# EAGLE schematic K9HZ_100W_Antenna_Tuner_Schematic_V1.10 (EAGLE 7.5.0)
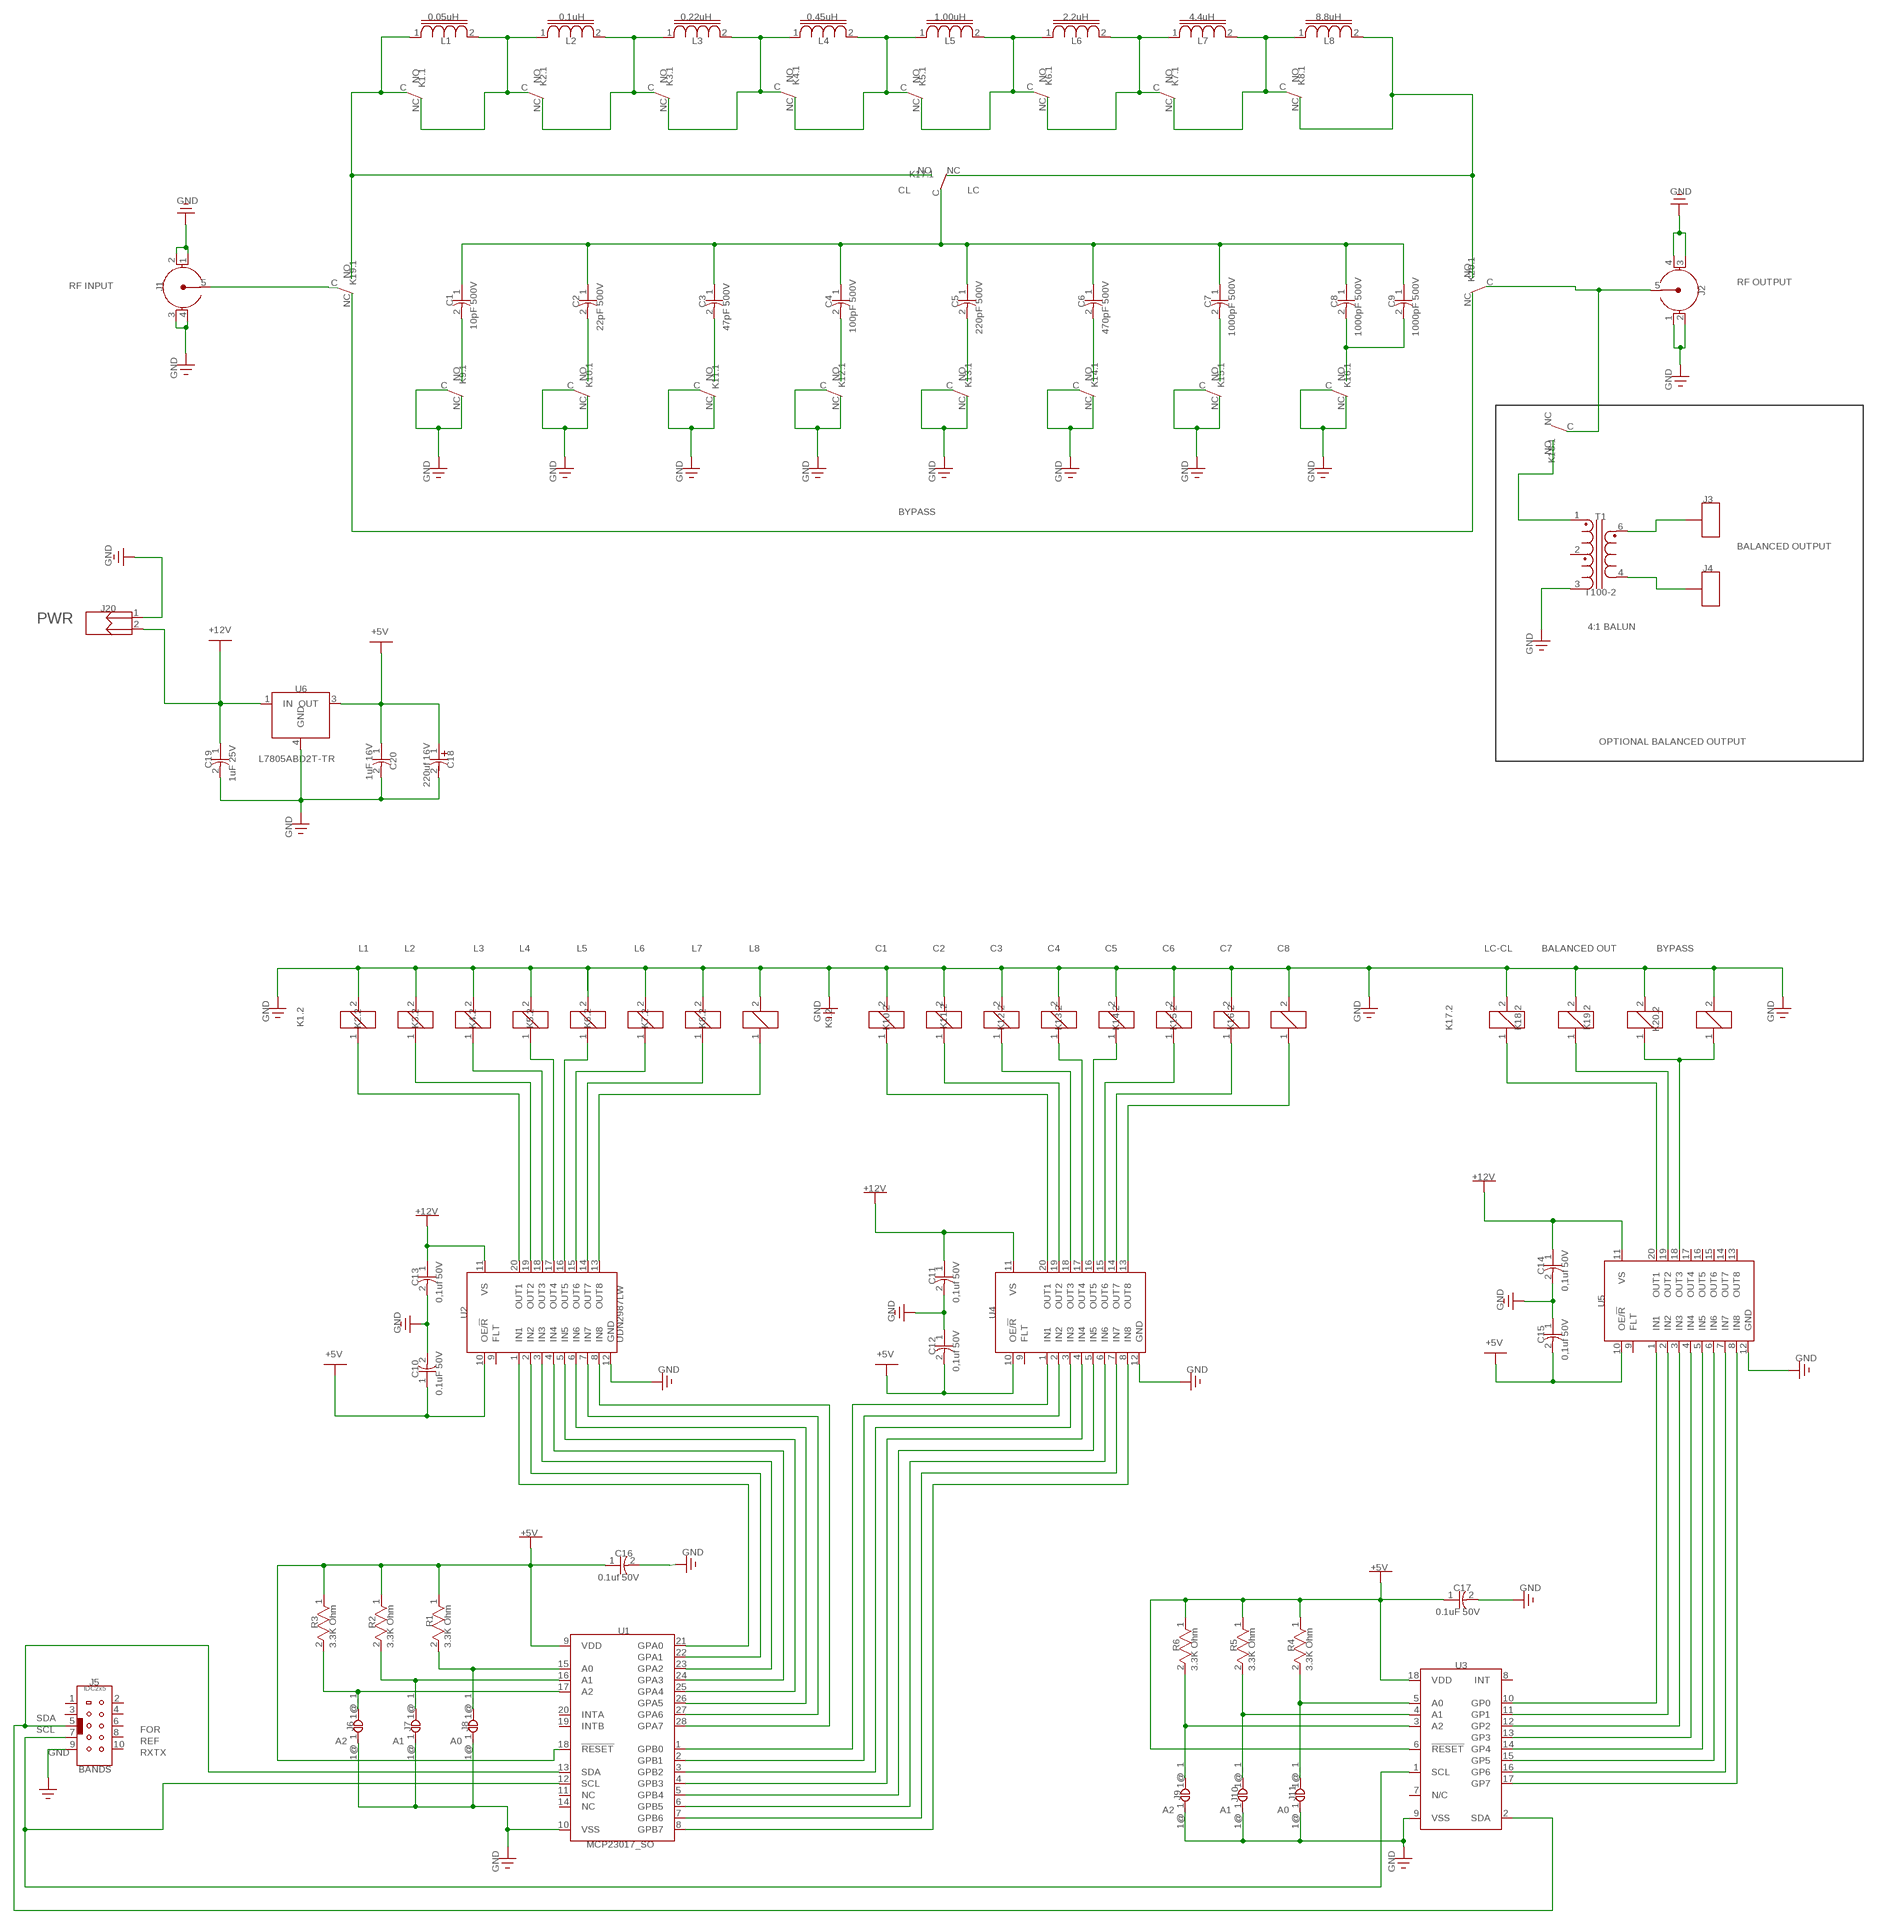
[diagram p0: schematic, sheet 1]

## Parts
C1  10pF 500V  CAP_1210  [CAP_0805]
C2  22pF 500V  CAP_1210  [CAP_0805]
C3  47pF 500V  CAP_1210  [CAP_0805]
C4  100pF 500V  CAP_1210  [CAP_0805]
C5  220pF 500V  CAP_1812  [CAP_0805]
C6  470pF 500V  CAP_1812  [CAP_0805]
C7  1000pF 500V  CAP_2220  [CAP_0805]
C8  1000pF 500V  CAP_2220  [CAP_0805]
C9  1000pF 500V  CAP_2220  [CAP_0805]
C10  0.1uF 50V  CAP_1206  [CAP_1206]
C11  0,1uf 50V  CAP_1206  [CAP_1206]
C12  0,1uf 50V  CAP_1206  [CAP_1206]
C13  0,1uf 50V  CAP_1206  [CAP_1206]
C14  0,1uf 50V  CAP_1206  [CAP_1206]
C15  0,1uf 50V  CAP_1206  [CAP_1206]
C16  0.1uf 50V  CAP_1206  [CAP_1206]
C17  0.1uF 50V  CAP_1206  [CAP_1206]
C18  220uf 16V  CAPAE_6.6X6.6H5.4  [CAPAE-6.6X6.6H5.4]
C19  1uF 25V  CAP_1206  [CAP_1206]
C20  1uF 16V  CAP_1206  [CAP_1206]
J1  901-144  [AMPHENOL_901-144]
J2  901-144  [AMPHENOL_901-144]
J3  CONN_FIXED  (no package)
J4  CONN_FIXED  (no package)
J5  BANDS  IDC2X5_MALE  [IDC10M]
J6  SOLDER_JMP_2  [SOLDER_JMP_2]
J7  SOLDER_JMP_2  [SOLDER_JMP_2]
J8  SOLDER_JMP_2  [SOLDER_JMP_2]
J9  SOLDER_JMP_2  [SOLDER_JMP_2]
J10  SOLDER_JMP_2  [SOLDER_JMP_2]
J11  SOLDER_JMP_2  [SOLDER_JMP_2]
J20  395310002  [TBH-1X2/5.08/2SH10X8]
K1  HF41F-12-ZS  [HF41F-12-ZS]
K2  HF41F-12-ZS  [HF41F-12-ZS]
K3  HF41F-12-ZS  [HF41F-12-ZS]
K4  HF41F-12-ZS  [HF41F-12-ZS]
K5  HF41F-12-ZS  [HF41F-12-ZS]
K6  HF41F-12-ZS  [HF41F-12-ZS]
K7  HF41F-12-ZS  [HF41F-12-ZS]
K8  HF41F-12-ZS  [HF41F-12-ZS]
K9  HF41F-12-ZS  [HF41F-12-ZS]
K10  HF41F-12-ZS  [HF41F-12-ZS]
K11  HF41F-12-ZS  [HF41F-12-ZS]
K12  HF41F-12-ZS  [HF41F-12-ZS]
K13  HF41F-12-ZS  [HF41F-12-ZS]
K14  HF41F-12-ZS  [HF41F-12-ZS]
K15  HF41F-12-ZS  [HF41F-12-ZS]
K16  HF41F-12-ZS  [HF41F-12-ZS]
K17  HF41F-12-ZS  [HF41F-12-ZS]
K18  HF41F-12-ZS_10  [HF41F-12-ZS]
K19  HF41F-12-ZS  [HF41F-12-ZS]
K20  HF41F-12-ZS_11  [HF41F-12-ZS]
L1  0.05uH  IND_IRON_CORE  [FC_INDUCTOR_0.5]
L2  0.1uH  IND_IRON_CORE  [FC_INDUCTOR_0.5]
L3  0.22uH  IND_IRON_CORE  [FC_INDUCTOR_0.5]
L4  0.45uH  IND_IRON_CORE  [FC_INDUCTOR_0.5]
L5  1.00uH  IND_IRON_CORE  [FC_INDUCTOR_0.5]
L6  2.2uH  IND_IRON_CORE  [FC_INDUCTOR_0.5]
L7  4.4uH  IND_IRON_CORE  [FC_INDUCTOR_0.5]
L8  8.8uH  IND_IRON_CORE  [FC_INDUCTOR_0.5]
R1  3.3K Ohm  RES_1206  [RES_1206]
R2  3.3K Ohm  RES_1206  [RES_1206]
R3  3.3K Ohm  RES_1206  [RES_1206]
R4  3.3K Ohm  RES_1206  [RES_1206]
R5  3.3K Ohm  RES_1206  [RES_1206]
R6  3.3K Ohm  RES_1206  [RES_1206]
T1  1T 4  T100-2  [BN43-202_VERT]
U1  MCP23017_SO  [SOIC-28/300MIL]
U2  UDN2987LW  [SOIC-20/300MIL]
U3  MCP23008-E/SO  [SOIC18P127_1155X1030X265L83X41N]
U4  UDN2987LW  [SOIC-20/300MIL]
U5  UDN2987LW  [SOIC-20/300MIL]
U6  L7805ABD2T-TR  [DPAK3P254_1542X460L203X81T800X870N_AP1]

## Nets
Net_0: J1.5(CON) K19.C(PART_1:COM)
Net_1: K19.NC(PART_1:NC) K20.NC(PART_1:NC)
Net_2: K1.C(PART_1:COM) K17.NO(PART_1:NO) K19.NO(PART_1:NO) L1.1(A)
Net_3: K1.NC(PART_1:NC) K2.C(PART_1:COM) L1.2(B) L2.1(A)
Net_4: K2.NC(PART_1:NC) K3.C(PART_1:COM) L2.2(B) L3.1(A)
Net_5: K3.NC(PART_1:NC) K4.C(PART_1:COM) L3.2(B) L4.1(A)
Net_6: K4.NC(PART_1:NC) K5.C(PART_1:COM) L4.2(B) L5.1(A)
Net_7: K5.NC(PART_1:NC) K6.C(PART_1:COM) L5.2(B) L6.1(A)
Net_8: K6.NC(PART_1:NC) K7.C(PART_1:COM) L6.2(B) L7.1(A)
Net_9: K7.NC(PART_1:NC) K8.C(PART_1:COM) L7.2(B) L8.1(A)
Net_10: K8.NC(PART_1:NC) K17.NC(PART_1:NC) K20.NO(PART_1:NO) L8.2(B)
Net_11: C1.1 C2.1 C3.1 C4.1 C5.1 C6.1 C7.1 C8.1 C9.1 K17.C(PART_1:COM)
Net_12: C6.2 K14.NO(PART_1:NO)
Net_13: C5.2 K13.NO(PART_1:NO)
Net_14: C3.2 K11.NO(PART_1:NO)
Net_15: C2.2 K10.NO(PART_1:NO)
Net_16: C1.2 K9.NO(PART_1:NO)
Net_17: C10.2 C11.2 C12.1 C13.2 C14.2 C15.1 C16.2 C17.2 C18.2(MINUS) C19.2 C20.2 J1.1(GND) J1.2(GND) J1.3(GND) J1.4(GND) J2.1(GND) J2.2(GND) J2.3(GND) J2.4(GND) J5.9 J6.1@_1 J7.1@_1 J8.1@_1 J9.1@_1 J10.1@_1 J11.1@_1 J20.1 K1.2 K2.2 K3.2 K4.2 K5.2 K6.2 K7.2 K8.2 K9.2 K9.C(PART_1:COM) K9.NC(PART_1:NC) K10.2 K10.C(PART_1:COM) K10.NC(PART_1:NC) K11.2 K11.C(PART_1:COM) K11.NC(PART_1:NC) K12.2 K12.C(PART_1:COM) K12.NC(PART_1:NC) K13.2 K13.C(PART_1:COM) K13.NC(PART_1:NC) K14.2 K14.C(PART_1:COM) K14.NC(PART_1:NC) K15.2 K15.C(PART_1:COM) K15.NC(PART_1:NC) K16.2 K16.C(PART_1:COM) K16.NC(PART_1:NC) K17.2 K18.2 K19.2 K20.2 T1.3 U1.10(VSS) U2.12(GND) U3.9(VSS) U4.12(GND) U5.12(GND) U6.4(GND) ; supply symbol labelled GND, MAIN_GND
Net_18: J2.5(CON) K18.C(PART_1:COM) K20.C(PART_1:COM)
Net_19: K18.NO(PART_1:NO) T1.1
Net_20: K3.1 U2.18(OUT3)
Net_21: K7.1 U2.14(OUT7)
Net_22: C4.2 K12.NO(PART_1:NO)
Net_23: J3.1 T1.6
Net_24: J4.1 T1.4
Net_25: K11.1 U4.18(OUT3)
Net_26: C7.2 K15.NO(PART_1:NO)
Net_27: C8.2 C9.2 K16.NO(PART_1:NO)
Net_28: J7.1@_1 R2.2 U1.16(A1)
Net_29: J6.1@_1 R3.2 U1.17(A2)
Net_30: J5.5 U1.13(SDA) U3.2(SDA)
Net_31: J5.7 U1.12(SCL) U3.1(SCL)
Net_32: J11.1@_1 R4.2 U3.5(A0)
Net_33: K13.1 U4.16(OUT5)
Net_34: K16.1 U4.13(OUT8)
Net_35: J9.1@_1 R6.2 U3.3(A2)
Net_36: K18.1 U5.19(OUT2)
Net_37: U3.11(GP1) U5.2(IN2)
Net_38: U3.14(GP4) U5.5(IN5)
Net_39: U1.21(GPA0) U2.1(IN1)
Net_40: U3.17(GP7) U5.8(IN8)
Net_42: U1.22(GPA1) U2.2(IN2)
Net_46: U1.23(GPA2) U2.3(IN3)
Net_48: K17.1 U5.20(OUT1)
Net_49: U3.10(GP0) U5.1(IN1)
Net_50: U1.24(GPA3) U2.4(IN4)
Net_51: U3.12(GP2) U5.3(IN3)
Net_54: U1.25(GPA4) U2.5(IN5)
Net_56: K1.1 U2.20(OUT1)
Net_57: K2.1 U2.19(OUT2)
Net_58: U1.26(GPA5) U2.6(IN6)
Net_59: K4.1 U2.17(OUT4)
Net_60: K5.1 U2.16(OUT5)
Net_61: K6.1 U2.15(OUT6)
Net_62: U1.27(GPA6) U2.7(IN7)
Net_63: K8.1 U2.13(OUT8)
Net_64: K9.1 U4.20(OUT1)
Net_65: K10.1 U4.19(OUT2)
Net_66: U1.28(GPA7) U2.8(IN8)
Net_67: K12.1 U4.17(OUT4)
Net_68: C10.1 C12.2 C15.2 C16.1 C17.1 C18.1(PLUS) C20.1 R1.1 R2.1 R3.1 R4.1 R5.1 R6.1 U1.9(VDD) U1.18(!RESET!) U2.10(OE/!R) U3.6(!RESET!) U3.18(VDD) U4.10(OE/!R) U5.10(OE/!R) U6.3(OUT) ; supply symbol labelled +5V
Net_69: K14.1 U4.15(OUT6)
Net_70: K15.1 U4.14(OUT7)
Net_71: U1.1(GPB0) U4.1(IN1)
Net_72: C11.1 C13.1 C14.1 C19.1 J20.2 U2.11(VS) U4.11(VS) U5.11(VS) U6.1(IN) ; supply symbol labelled +12V
Net_74: U3.13(GP3) U5.4(IN4)
Net_75: U1.2(GPB1) U4.2(IN2)
Net_77: U3.15(GP5) U5.6(IN6)
Net_78: U3.16(GP6) U5.7(IN7)
Net_79: U1.3(GPB2) U4.3(IN3)
Net_83: U1.4(GPB3) U4.4(IN4)
Net_87: U1.5(GPB4) U4.5(IN5)
Net_91: U1.6(GPB5) U4.6(IN6)
Net_95: U1.7(GPB6) U4.7(IN7)
Net_96: J10.1@_1 R5.2 U3.4(A1)
Net_99: U1.8(GPB7) U4.8(IN8)
Net_113: K19.1 K20.1 U5.18(OUT3)
Net_132: J8.1@_1 R1.2 U1.15(A0)
Unconnected: J5.1 J5.2 J5.3 J5.4 J5.6 J5.8 J5.10 K1.NO(PART_1:NO) K2.NO(PART_1:NO) K3.NO(PART_1:NO) K4.NO(PART_1:NO) K5.NO(PART_1:NO) K6.NO(PART_1:NO) K7.NO(PART_1:NO) K8.NO(PART_1:NO) K18.NC(PART_1:NC) T1.2 U1.11(NC) U1.14(NC) U1.19(INTB) U1.20(INTA) U2.9(FLT) U3.7(N/C) U3.8(INT) U4.9(FLT) U5.9(FLT) U5.13(OUT8) U5.14(OUT7) U5.15(OUT6) U5.16(OUT5) U5.17(OUT4)

## Notes on the sheet
- 0.05uH | 0.1uH | 0.22uH | 0.45uH | 1.00uH | 2.2uH | 4.4uH | 8.8uH
- L1 | L2 | L3 | L4 | L5 | L6 | L7 | L8
- K1.1 | K2.1 | K3.1 | K4.1 | K5.1 | K6.1 | K7.1 | K8.1
- K17.1
- CL | LC
- GND
- GND
- K19.1
- RF OUTPUT
- RF INPUT | K20.1
- J1
- J2
- C1 | C2 | C3 | C4 | C5 | C6 | C7 | C8 | C9
- 10pF 500V | 22pF 500V | 47pF 500V
- 100pF 500V | 220pF 500V | 470pF 500V
- 1000pF 500V | 1000pF 500V | 1000pF 500V
- K9.1 | K10.1 | K11.1 | K12.1 | K13.1 | K14.1 | K15.1 | K16.1
- GND
- GND
- K18.1
- GND | GND | GND | GND | GND | GND | GND | GND
- J3
- BYPASS
- T1
- BALANCED OUTPUT
- GND
- J4
- T100-2
- PWR | J20
- 4:1 BALUN
- +12V | +5V
- GND
- U6
- OPTIONAL BALANCED OUTPUT
- L7805ABD2T-TR
- C19 | C20 | C18
- 1uF 25V | 1uF 16V
- 220uf 16V
- GND
- L1 | L2 | L3 | L4 | L5 | L6 | L7 | L8 | C1 | C2 | C3 | C4 | C5 | C6 | C7 | C8 | LC-CL | BALANCED OUT | BYPASS
- GND | GND | GND | GND
- K1.2 | K2.2 | K3.2 | K4.2 | K5.2 | K6.2 | K7.2 | K8.2 | K9.2 | K11.2
- K10.2 | K12.2 | K13.2 | K14.2 | K15.2 | K16.2 | K17.2 | K18.2 | K19.2 | K20.2
- +12V
- +12V
- +12V
- C14
- C13 | C11
- 0,1uf 50V
- 0,1uf 50V | 0,1uf 50V
- U5
- GND
- U2 | U4
- GND
- GND
- UDN2987LW | C15
- +5V
- C12
- +5V | +5V
- 0,1uf 50V | GND
- GND | 0,1uf 50V | GND
- C10
- 0.1uF 50V
- +5V
- C16 | GND
- +5V
- 0.1uf 50V
- C17 | GND
- 0.1uF 50V
- R3 | R2 | R1
- U1
- 3.3K Ohm | 3.3K Ohm | 3.3K Ohm
- R6 | R5 | R4
- 3.3K Ohm | 3.3K Ohm | 3.3K Ohm | U3
- IDC2x5 | J5
- SDA
- SCL | FOR
- J6 | J7 | J8
- REF | A2 | A1 | A0
- GND | RXTX
- BANDS
- J9 | J10 | J11
- A2 | A1 | A0
- MCP23017_SO
- GND | GND

## Library data of the parts
C1 = common:CAP_1210; MANUFACTURER: MC12CD100D-TF
C2-C4 = common:CAP_1210; MANUFACTURER: MC12CD100D-TF; VALUE: 10pF 500V
C5 = common:CAP_1812; MANUFACTURER: MC18FD221J-F
C6 = common:CAP_1812; MANUFACTURER: MC18FD221J-F; VALUE: 220pF 500V
C7-C9 = common:CAP_2220; MANUFACTURER: MC22FD102J-F
C10 C17 = common:CAP_1206
C11-C16 C19 C20 = common:CAP_1206; VALUE: 0.1uF 50V
C18 = common:CAPAE_6.6X6.6H5.4
J1 J2 = common:901-144; DATASHEET: http://datasheets.diptrace.com/con_rf_coax/sma_901.pdf; MANUFACTURER: Amphenol; PART_NUMBER_(DIGI-KEY): ARF1205-ND; PART_NUMBER_(MOUSER): 523-901-144; UNIQUE_NAME: AMPHENOL_901-144
J3 J4 = common:CONN_FIXED; DESCRIPTION: Connector; UNTITLED: Fixed Portion
J5 = common:IDC2X5_MALE
J6-J11 = common:SOLDER_JMP_2
J20 = common:395310002; DATASHEET: http://datasheets.diptrace.com/con_tb_headers/395310002_sd.pdf; MANUFACTURER: Molex
K1-K17 K19 = common:HF41F-12-ZS
K18 = common:HF41F-12-ZS_10
K20 = common:HF41F-12-ZS_11
L1 = common:IND_IRON_CORE; DESCRIPTION: Inductor; MANUFACTURER: T68-2; UNTITLED: Fixed
L2-L8 = common:IND_IRON_CORE; DESCRIPTION: Inductor; MANUFACTURER: T68-2; UNTITLED: Fixed; VALUE: 0.05uH
R1-R6 = common:RES_1206
T1 = common:T100-2; DATASHEET: http://datasheets.diptrace.com/transformers/0553-0013-BC-F.pdf; MANUFACTURER: BEL
U1 = common:MCP23017_SO; DATASHEET: http://datasheets.diptrace.com/microchip/21952b.pdf; MANUFACTURER: Microchip
U2 U4 U5 = common:UDN2987LW; DATASHEET: http://datasheets.diptrace.com/allegro/2987.pdf; MANUFACTURER: Allegro
U3 = common:MCP23008-E/SO; DATASHEET: http://datasheets.diptrace.com/microchip/21919e.pdf; MANUFACTURER: Microchip; PART_NUMBER_(DIGI-KEY): MCP23008-E/SO-ND; PART_NUMBER_(LCSC): C92253; PART_NUMBER_(MOUSER): 579-MCP23008-E/SO; UNIQUE_NAME: MICROCHIP_C04-051B
U6 = common:L7805ABD2T-TR; DATASHEET: http://datasheets.diptrace.com/hgc/L7805CV_and_series.pdf; MANUFACTURER: ST Microelectronics; PART_NUMBER_(LCSC): C86206; UNIQUE_NAME: ST_DPAK-3_2.54 pitch_15.425x10.14